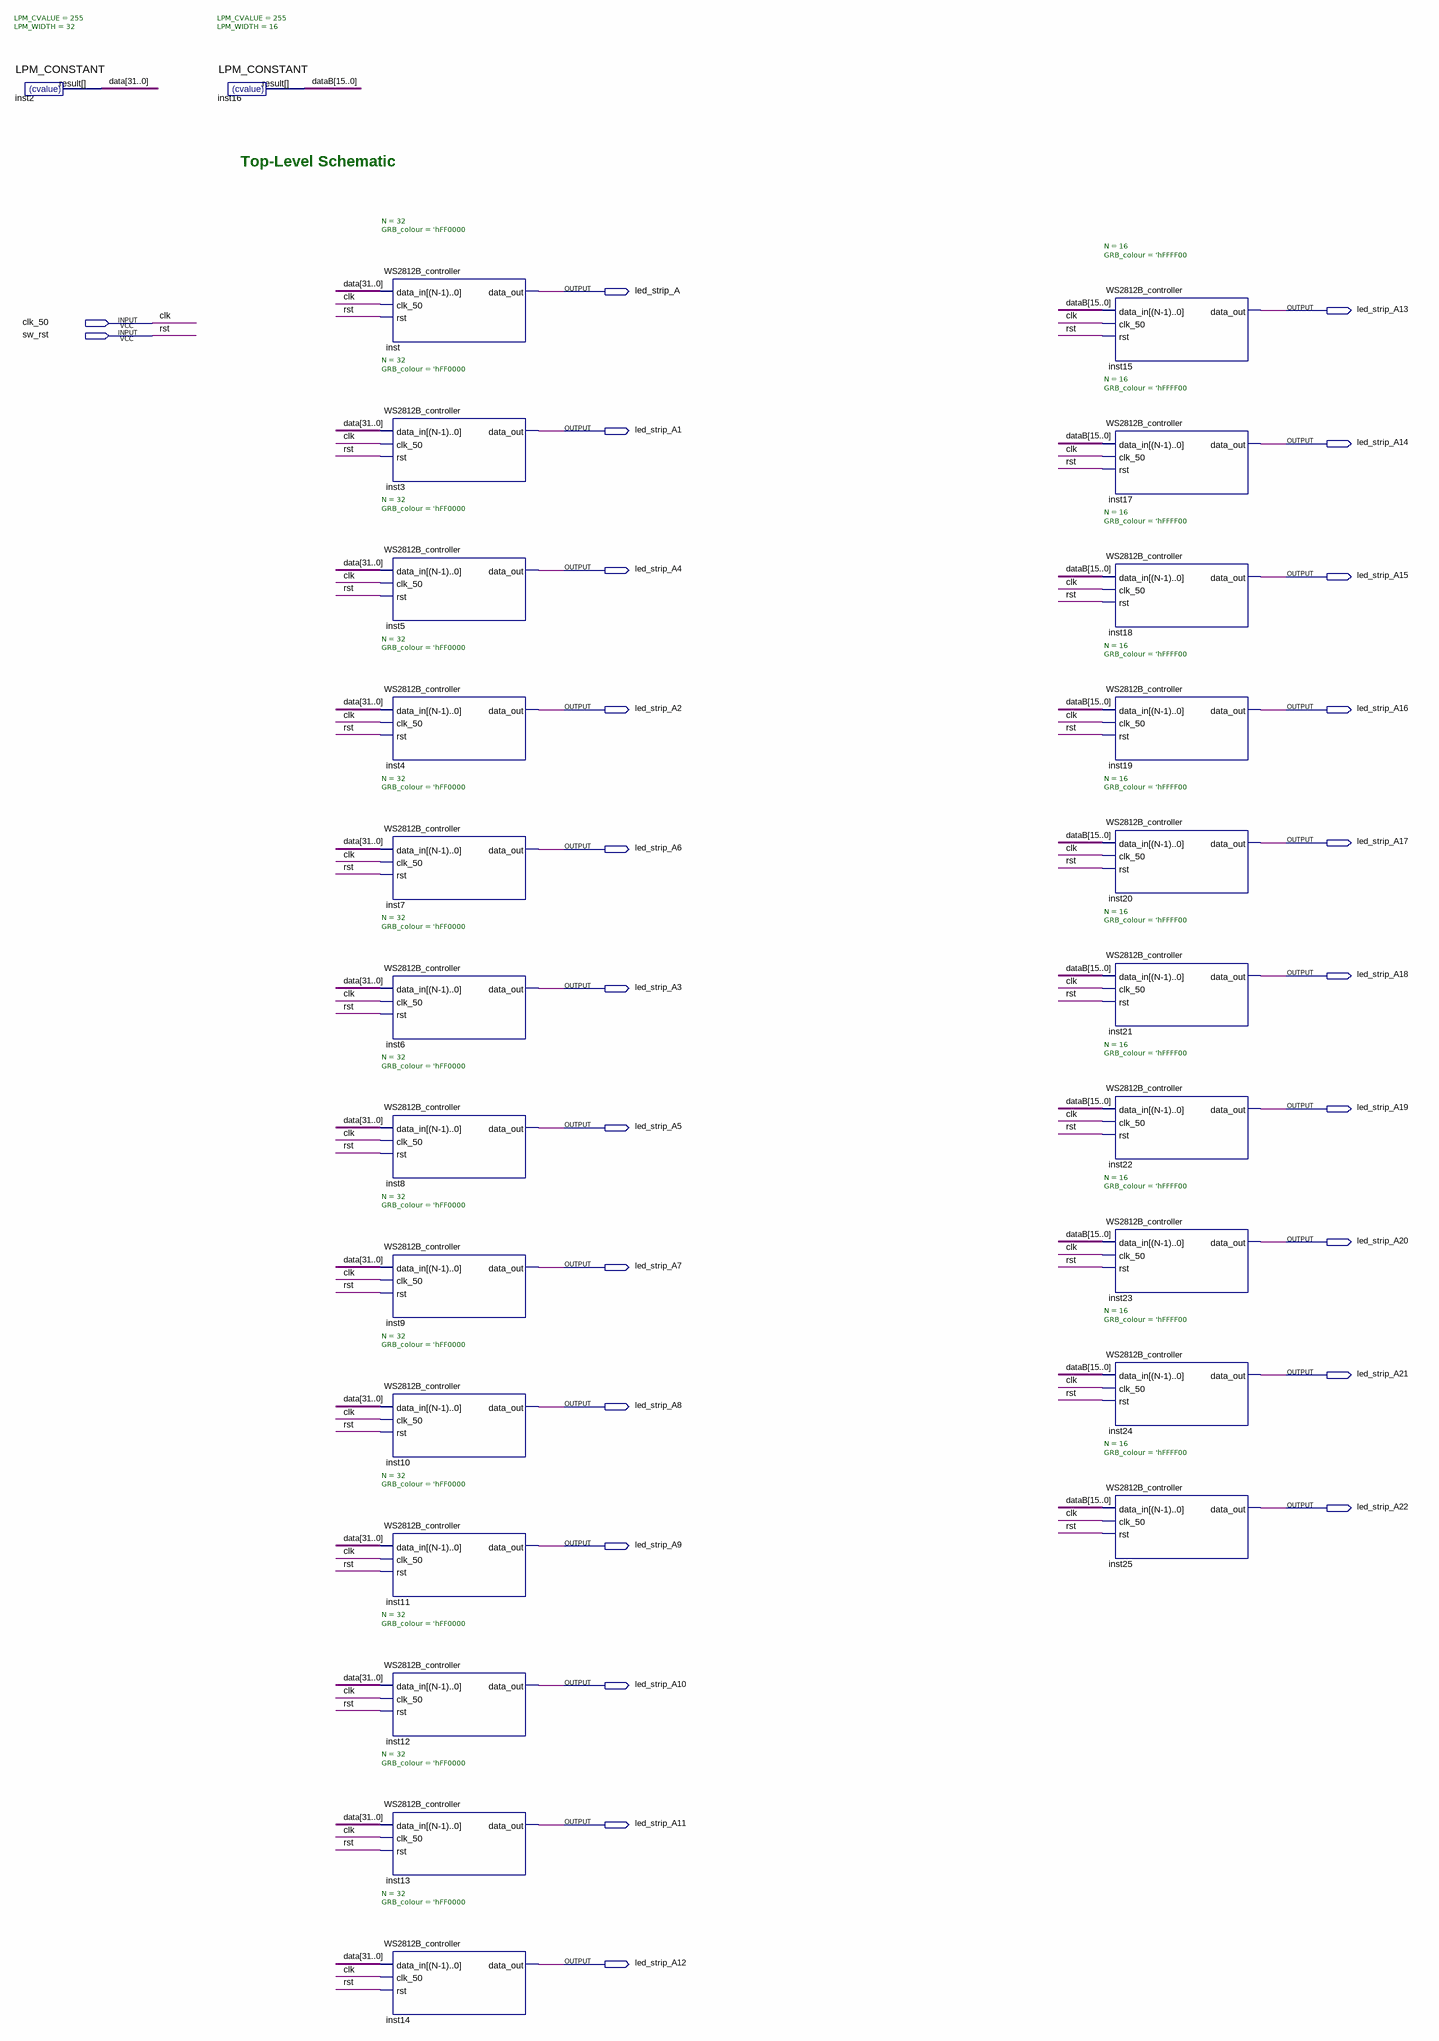
[diagram p0: schematic sheet]
// Quartus schematic WS2812BCONTROLLER.bdf as structural Verilog: 25 symbols, 25 pins
module WS2812BCONTROLLER (
  input  clk_50,
  input  sw_rst,
  output led_strip_A,
  output led_strip_A13,
  output led_strip_A1,
  output led_strip_A14,
  output led_strip_A4,
  output led_strip_A15,
  output led_strip_A2,
  output led_strip_A16,
  output led_strip_A17,
  output led_strip_A6,
  output led_strip_A18,
  output led_strip_A3,
  output led_strip_A19,
  output led_strip_A5,
  output led_strip_A20,
  output led_strip_A7,
  output led_strip_A21,
  output led_strip_A8,
  output led_strip_A22,
  output led_strip_A9,
  output led_strip_A10,
  output led_strip_A11,
  output led_strip_A12
);

  wire [15:0] dataB;
  wire [31:0] data;

  LPM_CONSTANT #(.LPM_CVALUE(255), .LPM_WIDTH(32)) inst2 (.result(data));
  LPM_CONSTANT #(.LPM_CVALUE(255), .LPM_WIDTH(16)) inst16 (.result(dataB));
  WS2812B_controller #(.N(32), .GRB_colour('hFF0000)) inst (
    .data_in(data), .clk_50(clk_50), .rst(sw_rst), .data_out(led_strip_A));
  WS2812B_controller #(.N(32), .GRB_colour('hFF0000)) inst3 (
    .data_in(data), .clk_50(clk_50), .rst(sw_rst), .data_out(led_strip_A1));
  WS2812B_controller #(.N(32), .GRB_colour('hFF0000)) inst5 (
    .data_in(data), .clk_50(clk_50), .rst(sw_rst), .data_out(led_strip_A4));
  WS2812B_controller #(.N(32), .GRB_colour('hFF0000)) inst4 (
    .data_in(data), .clk_50(clk_50), .rst(sw_rst), .data_out(led_strip_A2));
  WS2812B_controller #(.N(32), .GRB_colour('hFF0000)) inst7 (
    .data_in(data), .clk_50(clk_50), .rst(sw_rst), .data_out(led_strip_A6));
  WS2812B_controller #(.N(32), .GRB_colour('hFF0000)) inst6 (
    .data_in(data), .clk_50(clk_50), .rst(sw_rst), .data_out(led_strip_A3));
  WS2812B_controller #(.N(32), .GRB_colour('hFF0000)) inst8 (
    .data_in(data), .clk_50(clk_50), .rst(sw_rst), .data_out(led_strip_A5));
  WS2812B_controller #(.N(32), .GRB_colour('hFF0000)) inst9 (
    .data_in(data), .clk_50(clk_50), .rst(sw_rst), .data_out(led_strip_A7));
  WS2812B_controller #(.N(32), .GRB_colour('hFF0000)) inst10 (
    .data_in(data), .clk_50(clk_50), .rst(sw_rst), .data_out(led_strip_A8));
  WS2812B_controller #(.N(32), .GRB_colour('hFF0000)) inst11 (
    .data_in(data), .clk_50(clk_50), .rst(sw_rst), .data_out(led_strip_A9));
  WS2812B_controller #(.N(32), .GRB_colour('hFF0000)) inst12 (
    .data_in(data), .clk_50(clk_50), .rst(sw_rst), .data_out(led_strip_A10));
  WS2812B_controller #(.N(32), .GRB_colour('hFF0000)) inst13 (
    .data_in(data), .clk_50(clk_50), .rst(sw_rst), .data_out(led_strip_A11));
  WS2812B_controller #(.N(32), .GRB_colour('hFF0000)) inst14 (
    .data_in(data), .clk_50(clk_50), .rst(sw_rst), .data_out(led_strip_A12));
  WS2812B_controller #(.N(16), .GRB_colour('hFFFF00)) inst15 (
    .data_in(dataB), .clk_50(clk_50), .rst(sw_rst), .data_out(led_strip_A13));
  WS2812B_controller #(.N(16), .GRB_colour('hFFFF00)) inst17 (
    .data_in(dataB), .clk_50(clk_50), .rst(sw_rst), .data_out(led_strip_A14));
  WS2812B_controller #(.N(16), .GRB_colour('hFFFF00)) inst18 (
    .data_in(dataB), .clk_50(clk_50), .rst(sw_rst), .data_out(led_strip_A15));
  WS2812B_controller #(.N(16), .GRB_colour('hFFFF00)) inst19 (
    .data_in(dataB), .clk_50(clk_50), .rst(sw_rst), .data_out(led_strip_A16));
  WS2812B_controller #(.N(16), .GRB_colour('hFFFF00)) inst20 (
    .data_in(dataB), .clk_50(clk_50), .rst(sw_rst), .data_out(led_strip_A17));
  WS2812B_controller #(.N(16), .GRB_colour('hFFFF00)) inst21 (
    .data_in(dataB), .clk_50(clk_50), .rst(sw_rst), .data_out(led_strip_A18));
  WS2812B_controller #(.N(16), .GRB_colour('hFFFF00)) inst22 (
    .data_in(dataB), .clk_50(clk_50), .rst(sw_rst), .data_out(led_strip_A19));
  WS2812B_controller #(.N(16), .GRB_colour('hFFFF00)) inst23 (
    .data_in(dataB), .clk_50(clk_50), .rst(sw_rst), .data_out(led_strip_A20));
  WS2812B_controller #(.N(16), .GRB_colour('hFFFF00)) inst24 (
    .data_in(dataB), .clk_50(clk_50), .rst(sw_rst), .data_out(led_strip_A21));
  WS2812B_controller #(.N(16), .GRB_colour('hFFFF00)) inst25 (
    .data_in(dataB), .clk_50(clk_50), .rst(sw_rst), .data_out(led_strip_A22));

  // Other names for the same wires on the sheet: clk = clk_50; rst = sw_rst

  // Notes on the sheet:
  //   Top-Level Schematic
endmodule
